# Altium schematic sheet 3.3V_LDO_SUPPLY.SchDoc
size A
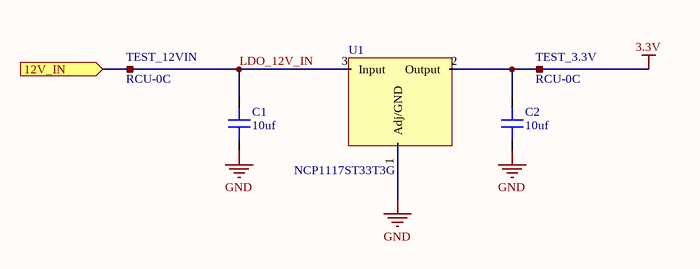
[diagram p0: 3.3V_LDO_SUPPLY.SchDoc]

## Parts
C1  value 10uf  [CAP 0603/1608]  (hidden comment: Capacitor MLCC 10uf 16V CAP 0603/1608)
C2  value 10uf  [CAP 0603/1608]  (hidden comment: Capacitor MLCC 10uf 16V CAP 0603/1608)
TEST_3.3V  RCU-0C  [RCU-0C]
TEST_12VIN  RCU-0C  [RCU-0C]
U1  NCP1117ST33T3G  [SOT-223-3]

## Ports
12V_IN (in)

## Nets
3.3V: C2.2 TEST_3.3V.1 U1.2(Output)
GND: C1.1 C2.1 U1.1(Adj/GND)
LDO_12V_IN: C1.2 TEST_12VIN.1 U1.3(Input) ; port 12V_IN

## Library data of the parts
C1 C2 = 235: Manufacturer_id: 1; idCapacitor: 235; Name: Cap_10uf_16V_CAP 0603/1608; Dielectric: Ceramic; Created_By: Nick Mah; Drawer_id: 1; Voltage_Rating: 16V; Package: CAP 0603/1608; Created_Date: 10/20/2018
TEST_3.3V TEST_12VIN = 5: Manufacturer_id: 1; idTable: 5; Name: RCU-0C_Test_Point; Drawer_id: 1; Package: 0603; MfrPartNo: RCU-0C; Link: https://www.digikey.com/product-detail/en/te-connectivity-amp-connectors/RCU-0C/A106145CT-ND/3477802; ComponentLink1Description: Datasheet; ComponentLink1URL: https://www.te.com/commerce/DocumentDelivery/DDEController?Action=srchrtrv&DocNm=1773266&DocType=DS&DocLang=English
U1 = 15: 1.0 A Low Dropout Positive and Adjustable Voltage Regulator; Manufacturer_id: 1; idPMIC_Lin: 15; Name: 3.3V 1.0A LDO; Value: 3.3V 1.0A; Vin(Max): 20V; Vout(Max): 3.3V; Current_Rating: 1A; Dropout_Voltage: 1.2V @ 800mA; Drawer_id: 1; Num_Outputs: 1; Package: SOT-223-3; MfrPartNo: NCP1117ST33T3G; Link: https://www.digikey.com/product-detail/en/on-semiconductor/NCP1117ST33T3G/NCP1117ST33T3GOSCT-ND/660708?utm_adgroup=Integrated%20Circuits&slid=&gclid=CjwKCAjwpKveBRAwEiwAo4Pqm-q33kFM8zFNc6HZ2F-pR13_ETd6YlqjCAqcJjAXoyQWdArbQQWp4hoCk3EQAvD_BwE